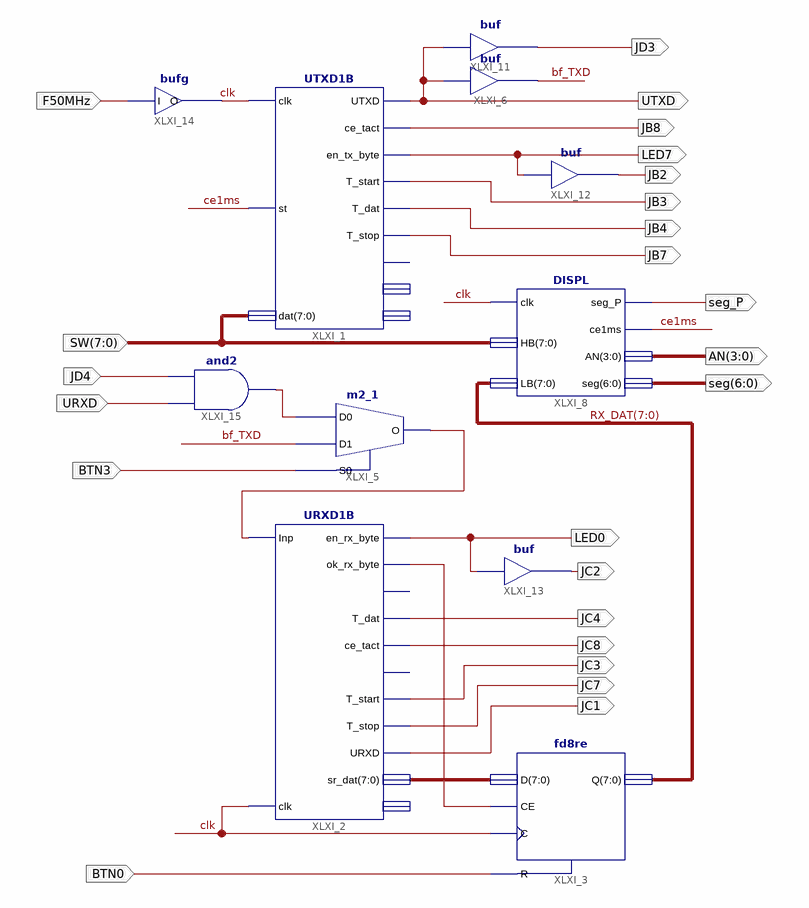
[diagram p0: schematic sheet 1]
// Xilinx ISE schematic Sch_LAB404_1B.sch (spartan3e) as structural Verilog: 11 symbols, 24 ports
module Sch_LAB404_1B (
  input  [7:0] SW,
  input  F50MHz,
  input  BTN3,
  input  BTN0,
  input  URXD,
  input  JD4,
  output LED7,
  output UTXD,
  output JB3,
  output JB4,
  output JB7,
  output JD3,
  output JB2,
  output seg_P,
  output [6:0] seg,
  output [3:0] AN,
  output JC3,
  output JC2,
  output JC4,
  output JC7,
  output JC1,
  output LED0,
  output JB8,
  output JC8
);

  wire bf_TXD, ce1ms, clk, XLXN_4, XLXN_116, XLXN_153;
  wire [7:0] RX_DAT, XLXN_1;

  UTXD1B XLXI_1 (
    .clk(clk), .st(ce1ms), .dat(SW), .UTXD(UTXD), .ce_tact(JB8), .en_tx_byte(LED7), .T_start(JB3),
    .T_dat(JB4), .T_stop(JB7));  // open: ce_stop, cb_bit, sr_dat
  buf XLXI_6 (bf_TXD, UTXD);
  buf XLXI_11 (JD3, UTXD);
  buf XLXI_12 (JB2, LED7);
  bufg XLXI_14 (.I(F50MHz), .O(clk));
  DISPL XLXI_8 (.clk(clk), .HB(SW), .LB(RX_DAT), .seg_P(seg_P), .ce1ms(ce1ms), .AN(AN), .seg(seg));
  m2_1 XLXI_5 (.D0(XLXN_153), .D1(bf_TXD), .S0(BTN3), .O(XLXN_116));
  URXD1B XLXI_2 (
    .Inp(XLXN_116), .clk(clk), .en_rx_byte(LED0), .ok_rx_byte(XLXN_4), .T_dat(JC4), .ce_tact(JC8),
    .T_start(JC3), .T_stop(JC7), .URXD(JC1), .sr_dat(XLXN_1));  // open: start, ce_bit, cb_bit
  fd8re XLXI_3 (.C(clk), .CE(XLXN_4), .D(XLXN_1), .R(BTN0), .Q(RX_DAT));
  buf XLXI_13 (JC2, LED0);
  and XLXI_15 (XLXN_153, URXD, JD4);
endmodule
